# Altium schematic sheet RP_ComputeModule3_rev.3.0_uSDCard.SchDoc
size A4 portrait
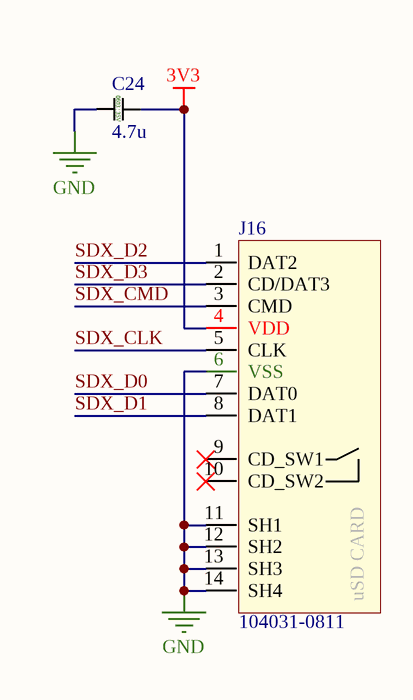
[diagram p0: RP_ComputeModule3_rev.3.0_uSDCard.SchDoc]

## Parts
C24  4.7u  [0603 Murata]
J16  104031-0811  [MOLEX 104031-0811]

## Nets
3V3: C24.2 J16.4(VDD)
GND: C24.1 J16.6(VSS) J16.11(SH1) J16.12(SH2) J16.13(SH3) J16.14(SH4)
SDX_CLK: J16.5(CLK)
SDX_CMD: J16.3(CMD)
SDX_D0: J16.7(DAT0)
SDX_D1: J16.8(DAT1)
SDX_D2: J16.1(DAT2)
SDX_D3: J16.2(CD/DAT3)

Not connected (* = marked no-connect by the designer): J16 9(CD_SW1)* 10(CD_SW2)*

## Notes on the sheet
- (in symbol 104031-0811) uSD CARD
- (in symbol GRT188R6YA475KE13D) 0603 | 35V

## Library data of the parts
C24 = GRT188R6YA475KE13D: 4.7µF 35V Ceramic Capacitor X5R 0603 (1608 Metric) 0.063" L x 0.031" W (1.60mm x 0.80mm); Manufacturer: Murata; Capacitance: 4.7uF; Tolerance: 10%; Supplier 1: Mouser; Manufacturer Part Number: GRT188R6YA475KE13D; Stock 1: 292; Pricing 1: 10000=0.133 (USD); Mount: Surface Mount; Case/Package: 0603; Case Code (Metric): 1608; Case Code (Imperial): 0603; Min Operating Temperature: -55°C; Max Operating Temperature: 85°C; Packaging: Tape and Reel; Voltage Rating: 35V; Length: 0.063inch; Width: 0.031inch; Thickness: 0.035inch; ComponentLink1URL: http://search.murata.co.jp/Ceramy/image/img/A01X/G101/ENG/GRT188R6YA475KE13-01.pdf; ComponentLink1Description: http://search.murata.co.jp/Ceramy/image/img/A01X/G101/ENG/GRT188R6YA475KE13-01.pdf
J16 = 104031-0811: CONN MICRO SD CARD PUSH-PULL R/A; Manufacturer: Molex; Number of Contacts: 8; Current Rating: 500mA; Voltage Rating (AC): 10V; Mating Cycles: 10000; Connector Type: Connector; Gender: Female; Pitch: 1.1mm; Supplier 1: Mouser; Manufacturer Part Number: 104031-0811; Stock 1: 13417; Pricing 1: 1=1.75, 10=1.59, 50=1.59, 100=1.36, 1000=0.97, 10000=0.86 (USD); Mount: Surface Mount,Standard; Contact Material: Bronze; Contact Plating: Nickel,Gold; Housing Material: Polymer; Min Operating Temperature: -25°C; Max Operating Temperature: 85°C; Number of Rows: 1; Orientation: Right Angle; Packaging: Tape and Reel; Package Quantity: 1; Termination: Solder; Number of Circuits: 8; Length: 11.14mm; Height: 1.42mm; Width: 11.4mm; Depth: 11.4mm; Radiation Hardening: No; REACH SVHC: Unknown; Halogen Free: Low Halogen; ComponentLink1URL: https://datasheet.ciiva.com/4581/1040310811-memory-card-socket-153593-4581012.pdf; ComponentLink1Description: https://datasheet.ciiva.com/4581/1040310811-memory-card-socket-153593-4581012.pdf; ComponentLink2URL: https://datasheet.ciiva.com/683/1040310811-sd-683579.pdf; ComponentLink2Description: https://datasheet.ciiva.com/683/1040310811-sd-683579.pdf; ComponentLink3URL: https://datasheet.ciiva.com/16655/1040310811-memory-card-socket-16655292.pdf; ComponentLink3Description: https://datasheet.ciiva.com/16655/1040310811-memory-card-socket-16655292.pdf; ComponentLink4URL: https://datasheet.ciiva.com/15174/getdatasheetpartid-716154-15174887.pdf; ComponentLink4Description: https://datasheet.ciiva.com/15174/getdatasheetpartid-716154-15174887.pdf; ComponentLink5URL: https://datasheet.ciiva.com/683/1040310811-sd-683580.pdf; ComponentLink5Description: https://datasheet.ciiva.com/683/1040310811-sd-683580.pdf; ComponentLink6URL: https://datasheet.ciiva.com/683/1040310811-sd-683581.pdf; ComponentLink6Description: https://datasheet.ciiva.com/683/1040310811-sd-683581.pdf; ComponentLink7URL: https://datasheet.ciiva.com/3121/1040310811-memory-card-socket-3121437.pdf; ComponentLink7Description: https://datasheet.ciiva.com/3121/1040310811-memory-card-socket-3121437.pdf; ComponentLink8URL: https://datasheet.ciiva.com/16496/1040310811-memory-card-socket-16496702.pdf; ComponentLink8Description: https://datasheet.ciiva.com/16496/1040310811-memory-card-socket-16496702.pdf